# Altium schematic sheet Sheet4_MCU_Sensors.SchDoc
size A; SheetNumber: 4; SheetTotal: 6
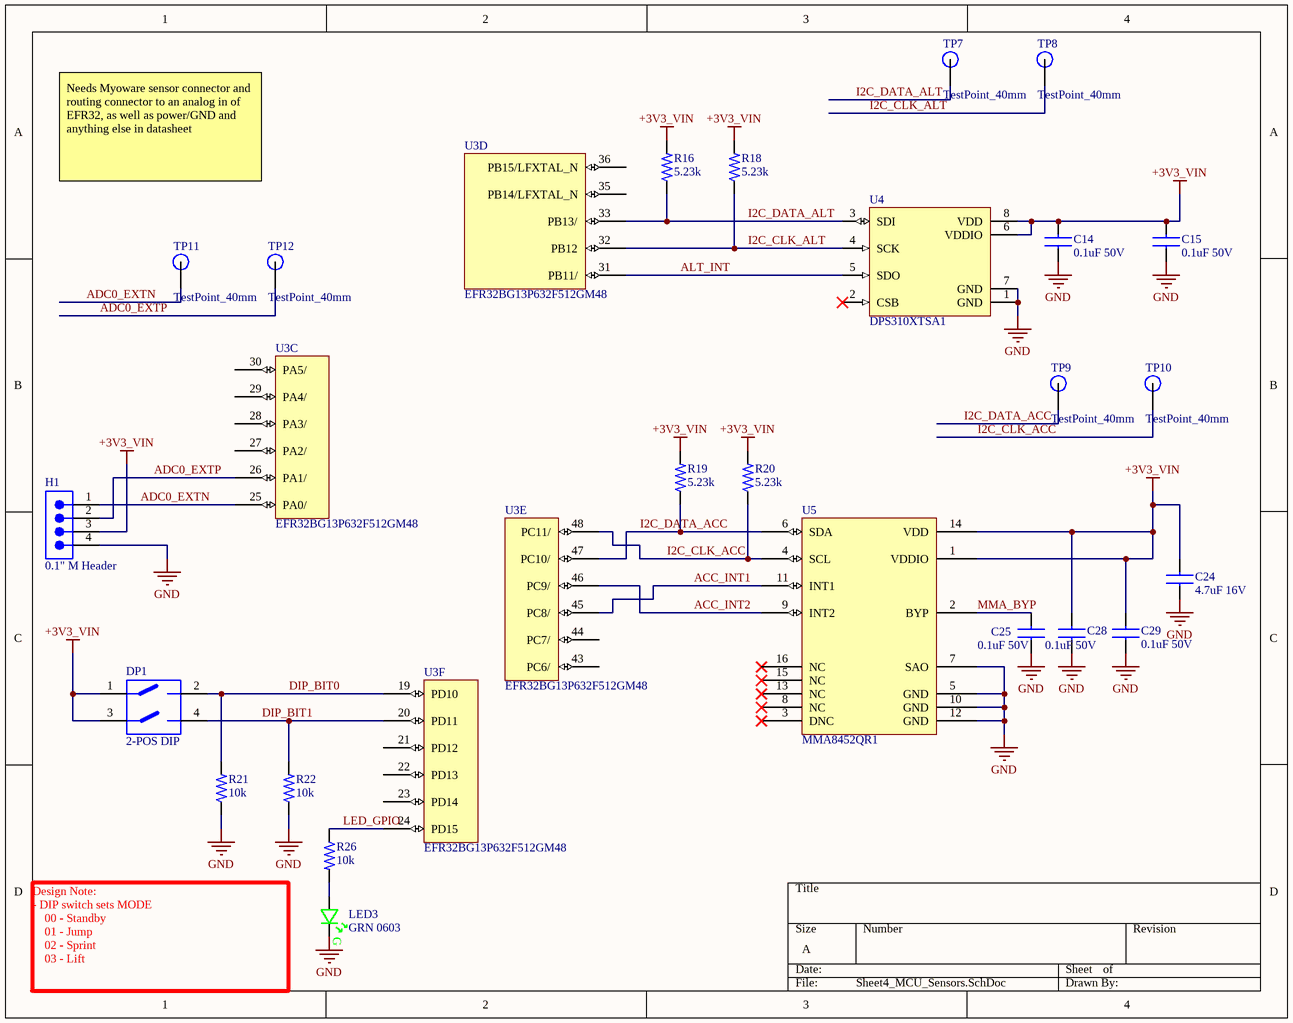
[diagram p0: Sheet4_MCU_Sensors.SchDoc]

## Parts
C14  0.1uF 50V  [CAP_0603_1MM]
C15  0.1uF 50V  [CAP_0603_1MM]
C24  4.7uF 16V  [CAP_0805_1_4MM]
C25  0.1uF 50V  [CAP_0603_1MM]
C28  0.1uF 50V  [CAP_0603_1MM]
C29  0.1uF 50V  [CAP_0603_1MM]
DP1  2-POS DIP  [4-PIN_DIP_2.54MM]
H1  0.1" M Header  [4-PIN_MALE_HEADER_01-IN]
LED3  GRN 0603  [LED_0603_GRN_WL-SMCW]
R16  5.23k  [RES_0603_1608X06]
R18  5.23k  [RES_0603_1608X06]
R19  5.23k  [RES_0603_1608X06]
R20  5.23k  [RES_0603_1608X06]
R21  10k  [RES_0805_2X1_25MM]
R22  10k  [RES_0805_2X1_25MM]
R26  10k  [RES_0805_2X1_25MM]
TP7  TestPoint_40mm  [TP_40MM]
TP8  TestPoint_40mm  [TP_40MM]
TP9  TestPoint_40mm  [TP_40MM]
TP10  TestPoint_40mm  [TP_40MM]
TP11  TestPoint_40mm  [TP_40MM]
TP12  TestPoint_40mm  [TP_40MM]
U3  EFR32BG13P632F512GM48  [QFN50P700X700X90_HS-49N]  (parts C,D,E,F of 7)
U4  DPS310XTSA1  [8-VLGA_2x2_5x1]
U5  MMA8452QR1  [MMA8452]

## Nets
+3V3_VIN: C14.1 C15.1 C24.2 C28.1 C29.1 DP1.1 DP1.3 H1.3 R16.2 R18.2 R19.2 R20.2 U4.6(VDDIO) U4.8(VDD) U5.1(VDDIO) U5.14(VDD)
GND: C14.2 C15.2 C24.1 C25.2 C28.2 C29.2 H1.4 LED3.C R21.1 R22.1 U4.1(GND) U4.7(GND) U5.5(GND) U5.7(SAO) U5.10(GND) U5.12(GND)
ACC_INT1: U3.45(PC8/) U5.11(INT1)
ACC_INT2: U3.46(PC9/) U5.9(INT2)
ADC0_EXTN: H1.1 TP11.1 U3.25(PA0/)
ADC0_EXTP: H1.2 TP12.1 U3.26(PA1/)
ALT_INT: U3.31(PB11/) U4.5(SDO)
DIP_BIT0: DP1.2 R21.2 U3.19(PD10)
DIP_BIT1: DP1.4 R22.2 U3.20(PD11)
I2C_CLK_ACC: R20.1 TP10.1 U3.48(PC11/) U5.4(SCL)
I2C_CLK_ALT: R18.1 TP8.1 U3.32(PB12) U4.4(SCK)
I2C_DATA_ACC: R19.1 TP9.1 U3.47(PC10/) U5.6(SDA)
I2C_DATA_ALT: R16.1 TP7.1 U3.33(PB13/) U4.3(SDI)
LED_GPIO: R26.1 U3.24(PD15)
MMA_BYP: C25.1 U5.2(BYP)
NetLED3_A: LED3.A R26.2

Not connected (* = marked no-connect by the designer): U3 21(PD12) 22(PD13) 23(PD14) 27(PA2/) 28(PA3/) 29(PA4/) 30(PA5/) 35(PB14/LFXTAL_N) 36(PB15/LFXTAL_N) 43(PC6/) 44(PC7/); U4 2(CSB)*; U5 3(DNC)* 8(NC)* 13(NC)* 15(NC)* 16(NC)*

## Notes on the sheet
- Needs Myoware sensor connector and routing connector to an analog in of EFR32, as well as power/GND and anything else in datasheet
- Design Note:
  - DIP switch sets MODE
  00 - Standby
  01 - Jump
  02 - Sprint
  03 - Lift
- (in symbol 150060GS75000) G

## Library data of the parts
C14 C15 C25 C28 C29 = CC0603KRX7R9BB104: CAPACITOR CERAMIC, 0.1UF, 50V, X7R, 10%, 0603; Manufacturer: Yageo; Capacitance: 100nF; Supplier 1: Digi-Key; Manufacturer Part Number: CC0603KRX7R9BB104; RoHS: Yes; Category: Ceramic Capacitors; Stock 1: 8863982; Pricing 1: 1=0.10000, 10=0.05900, 50=0.03240, 100=0.02640, 500=0.01886, 1000=0.01482 (USD); Mount: Surface Mount; Case/Package: 0603; Number of Pins: 2; Case Code (Metric): 1608; Case Code (Imperial): 0603; Dielectric Material: Ceramic; Min Operating Temperature: -55°C; Max Operating Temperature: 125°C; Package Quantity: 1; Voltage Rating: 50V; Tolerance: 10%; Packaging: Tape and Reel; Dielectric: X7R; Termination: SMD/SMT; Voltage: 50V; Series: CC; Length: 1.6mm; Width: 0.031inch; Height: 0.8mm; Thickness: 0.035inch; Depth: 0.8mm; Radiation Hardening: No; REACH SVHC: No SVHC; Lead Free: Lead Free; Halogen Free: Halogen Free; RoHS Compliant: Yes; ComponentLink1URL: https://datasheet.ciiva.com/11786/0900766b80d84f1d-11786061.pdf?src-supplier=RSComponents; ComponentLink1Description: https://datasheet.ciiva.com/11786/0900766b80d84f1d-11786061.pdf?src-supplier=RSComponents; ComponentLink2URL: https://datasheet.ciiva.com/144/mlccorderingcode-144176.pdf?src-supplier=Digi-Key; ComponentLink2Description: https://datasheet.ciiva.com/144/mlccorderingcode-144176.pdf?src-supplier=Digi-Key; ComponentLink3URL: https://datasheet.ciiva.com/144/mlccorderingcode-144177.pdf?src-supplier=Digi-Key; ComponentLink3Description: https://datasheet.ciiva.com/144/mlccorderingcode-144177.pdf?src-supplier=Digi-Key; ComponentLink4URL: https://datasheet.ciiva.com/144/mlccorderingcode-144178.pdf?src-supplier=Digi-Key; ComponentLink4Description: https://datasheet.ciiva.com/144/mlccorderingcode-144178.pdf?src-supplier=Digi-Key; ComponentLink5URL: https://datasheet.ciiva.com/31394/1489800-31394927.pdf?src-supplier=Farnell; ComponentLink5Description: https://datasheet.ciiva.com/31394/1489800-31394927.pdf?src-supplier=Farnell; ComponentLink6URL: https://datasheet.ciiva.com/8033/70765-8033819.pdf?src-supplier=Element14; ComponentLink6Description: https://datasheet.ciiva.com/8033/70765-8033819.pdf?src-supplier=Element14; ComponentLink7URL: https://datasheet.ciiva.com/8033/70765-8033821.pdf?src-supplier=Element14; ComponentLink7Description: https://datasheet.ciiva.com/8033/70765-8033821.pdf?src-supplier=Element14; ComponentLink8URL: https://datasheet.ciiva.com/22749/1489800-22749214.pdf?src-supplier=Element14; ComponentLink8Description: https://datasheet.ciiva.com/22749/1489800-22749214.pdf?src-supplier=Element14; ComponentLink9URL: https://datasheet.ciiva.com/7978/1489800-7978166.pdf?src-supplier=Element14; ComponentLink9Description: https://datasheet.ciiva.com/7978/1489800-7978166.pdf?src-supplier=Element14; ComponentLink10URL: https://datasheet.ciiva.com/16625/upy-gphc-x7r-6-3v-to-50v-8-16625530.pdf?src-supplier=Avnet+Europe; ComponentLink10Description: https://datasheet.ciiva.com/16625/upy-gphc-x7r-6-3v-to-50v-8-16625530.pdf?src-supplier=Avnet+Europe
C24 = CL21A475KOFNNNG: CAP CER 4.7UF 16V X5R 0805; Manufacturer: Samsung; Material: Ceramic; Tolerance: 10%; Supplier 1: Digi-Key; Manufacturer Part Number: CL21A475KOFNNNG; RoHS: Yes; Category: Ceramic Capacitors; Stock 1: 18827; Pricing 1: 1=0.12000, 10=0.08800, 50=0.05000, 100=0.04140, 500=0.02906, 1000=0.02405 (USD); Mount: Surface Mount; Case/Package: 0805; Case Code (Metric): 2012; Case Code (Imperial): 0805; Min Operating Temperature: -55°C; Max Operating Temperature: 85°C; Capacitance: 4.7uF; Package Quantity: 3000; Packaging: Tape and Reel; Voltage Rating: 16V; Dielectric: X5R; Voltage: 16V; Series: CL; Length: 2mm; Width: 0.049inch; Height: 1.25mm; Thickness: 0.053inch; Depth: 1.25mm; Lead Free: Lead Free; RoHS Compliant: Yes; ComponentLink1URL: https://datasheet.ciiva.com/25731/cl21a475kofnnng-25731814.pdf?src-supplier=Digi-Key; ComponentLink1Description: https://datasheet.ciiva.com/25731/cl21a475kofnnng-25731814.pdf?src-supplier=Digi-Key; ComponentLink2URL: https://datasheet.ciiva.com/29199/455276-da-01-en-vs-kondensator-0805-29199361.pdf?src-supplier=Conrad; ComponentLink2Description: https://datasheet.ciiva.com/29199/455276-da-01-en-vs-kondensator-0805-29199361.pdf?src-supplier=Conrad; ComponentLink3URL: https://datasheet.ciiva.com/26310/mlcc-catalogdownload2013-eng-26310158.pdf?src-supplier=Distrelec; ComponentLink3Description: https://datasheet.ciiva.com/26310/mlcc-catalogdownload2013-eng-26310158.pdf?src-supplier=Distrelec; ComponentLink4URL: https://datasheet.ciiva.com/16428/cl05b104kq5nnnc-16428879.pdf?src-supplier=Future+Electronics; ComponentLink4Description: https://datasheet.ciiva.com/16428/cl05b104kq5nnnc-16428879.pdf?src-supplier=Future+Electronics
DP1 = 206-2: SWITCH SLIDE DIP SPST 50MA 24V
H1 = PRPC004SAAN-RC: CONN HEADER VERT 4POS 2.54MM; Manufacturer: Sullins; Connector Type: Header, Unshrouded, Breakaway; Number of Positions: 4; Number of Positions Loaded: All; Pitch: 0.100" (2.54mm); Online Catalog: 0.100" (2.54mm) Pitch Connector Headers; Other Names: S9510E-04  S9510E-04-ND; Supplier 1: Digi-Key; Manufacturer Part Number: PRPC004SAAN-RC; Stock 1: 6306; Pricing 1: 1=0.15, 10=0.146, 25=0.1084, 50=0.0928, 100=0.0898, 250=0.0774, 500=0.0743 (USD); Standard Package: 1; Category: Connectors, Interconnects; Family: Rectangular Connectors - Headers, Male Pins; Series: -; Packaging: Bulk; Contact Type: Male Pin; Number of Rows: 1; Row Spacing: -; Contact Mating Length: 0.230" (5.84mm); Mounting Type: Through Hole; Termination: Solder; Fastening Type: -; Features: -; Contact Finish: Gold; Contact Finish Thickness: Flash; Color: Black; ComponentLink1URL: https://media.digikey.com/PDF/Data%20Sheets/Sullins%20PDFs/xRxCzzzSxxN-RC_ST_11635-B.pdf?src-supplier=Digi-Key; ComponentLink1Description: https://media.digikey.com/PDF/Data%20Sheets/Sullins%20PDFs/xRxCzzzSxxN-RC_ST_11635-B.pdf?src-supplier=Digi-Key; Supplier Part Number 1: S1011EC-04-ND
LED3 = 150060GS75000: LED, 0603, GREEN, 430MCD, 520NM; Manufacturer: Wurth Electronics; Dynamic Catalog: 0603 Rectangle with Flat Top Chip LEDs; 3D Model: SMCW_0603.igs / SMCW_0603.stp / SMCW_0603.wrl; Wavelength - Peak: 515nm; Voltage - Forward (Vf) (Typ): 3.2V; Current - Test: 20mA; Viewing Angle: 140°; Lens Type: Clear; Lens Style/Size: Rectangle with Flat Top, 1.1mm x 0.7mm; Other Names: 732-4971-2; Supplier 1: Digi-Key; Manufacturer Part Number: 150060GS75000; Stock 1: 34964; Pricing 1: 1=0.14, 50=0.129, 100=0.11, 500=0.095 (USD); Standard Package: 4,000; Category: Optoelectronics; Family: LED Indication - Discrete; Series: WL-SMCW; Packaging: Tape & Reel (TR); Color: Green; Wavelength - Dominant: 520nm; Millicandela Rating: 430mcd; Package / Case: 0603 (1608 Metric); Size / Dimension: 1.60mm L x 0.80mm W; Height: 0.70mm; Mounting Type: Surface Mount; Online Catalog: 0603 Rectangle with Flat Top Chip LEDs; ComponentLink1URL: https://katalog.we-online.de/led/datasheet/150060GS75000.pdf?src-supplier=Digi-Key; ComponentLink1Description: https://katalog.we-online.de/led/datasheet/150060GS75000.pdf?src-supplier=Digi-Key; ComponentLink2URL: http://www.produktinfo.conrad.com/datenblaetter/750000-774999/759427-da-01-en-CHIPLED_0603_W_KL_GRUEN_150060GS75000.pdf?src-supplier=Conrad; ComponentLink2Description: http://www.produktinfo.conrad.com/datenblaetter/750000-774999/759427-da-01-en-CHIPLED_0603_W_KL_GRUEN_150060GS75000.pdf?src-supplier=Conrad; Supplier Part Number 1: 732-4971-1-ND
R16 R18-R20 = RMCF0603FT5K23: RES SMD 5.23K OHM 1% 1/10W 0603; Manufacturer: Stackpole Electronics; Resistance: 5.23kR; Max Power Dissipation: 100mW; Temperature Coefficient: 100ppm/°C; Supplier 1: Digi-Key; Manufacturer Part Number: RMCF0603FT5K23; RoHS: Yes; Category: Chip SMD Resistors; Stock 1: 29980; Pricing 1: 1=0.10000, 10=0.01600, 100=0.00650, 1000=0.00292, 2500=0.00253 (USD); Mount: Surface Mount; Case/Package: 0603; Case Code (Metric): 1608; Case Code (Imperial): 0603; Contact Plating: Tin,Matte; Min Operating Temperature: -55°C; Max Operating Temperature: 155°C; Tolerance: 1%; Features: Automotive AEC-Q200; Packaging: Tape and Reel; Resistor Type: Thick Film; Number of Terminations: 2; Series: RMCF; Length: 0.061inch; Width: 0.031inch; Height: 0.022inch; Radiation Hardening: No; Lead Free: Lead Free; RoHS Compliant: Yes; ComponentLink1URL: https://www.seielect.com/Catalog/SEI-RMCF_RMCP.pdf?src-supplier=Digi-Key; ComponentLink1Description: https://www.seielect.com/Catalog/SEI-RMCF_RMCP.pdf?src-supplier=Digi-Key; ComponentLink2URL: https://www.seielect.com/catalog/SEI-Packaging.pdf?src-supplier=Digi-Key; ComponentLink2Description: https://www.seielect.com/catalog/SEI-Packaging.pdf?src-supplier=Digi-Key; ComponentLink3URL: https://www.seielect.com/catalog/SEI-RMCF_RMCP.pdf?src-supplier=Avnet; ComponentLink3Description: https://www.seielect.com/catalog/SEI-RMCF_RMCP.pdf?src-supplier=Avnet
R21 R22 R26 = RMCF0805FT10K0: RES 10K OHM 1% 1/8W 0805; Manufacturer: Stackpole Electronics; Resistance: 10kR; Power Rating: 125mW; Temperature Coefficient: 100ppm/°C; Supplier 1: Digi-Key; Manufacturer Part Number: RMCF0805FT10K0; RoHS: Yes; Category: Chip SMD Resistors; Stock 1: 2466676; Pricing 1: 1=0.10000, 10=0.02600, 100=0.01040, 1000=0.00466, 2500=0.00405 (USD); Mount: Surface Mount; Case/Package: 0805; Case Code (Metric): 2012; Case Code (Imperial): 0805; Contact Plating: Tin,Matte; Size Code: 0805; Min Operating Temperature: -55°C; Max Operating Temperature: 155°C; Tolerance: 1%; Packaging: Tape and Reel; Resistor Type: Thick Film; Number of Terminations: 2; Max Power Dissipation: 125mW; Features: Automotive AEC-Q200; Series: RMCF; Construction: Rectangular; Length: 2mm; Width: 0.049inch; Height: 0.026inch; Depth: 1.25mm; Radiation Hardening: No; Lead Free: Lead Free; Military Standard: Not; RoHS Compliant: Yes; ComponentLink1URL: https://datasheet.ciiva.com/15193/getdatasheetpartid-362046-15193525.pdf?src-supplier=Verical; ComponentLink1Description: https://datasheet.ciiva.com/15193/getdatasheetpartid-362046-15193525.pdf?src-supplier=Verical
U3 = EFR32BG13P732F512GM48-B_1: BLUE PREMIUM QFN48 2.4G 19 DBM B; Manufacturer: Silicon Labs; Interface: I2C,UART,USART; Frequency: 2.4GHz; Data Rate: 2Mbps; Sensitivity: -102dBm; Memory Size: 64KB; Number of GPIO: 31; Current - Receiving: 11mA; Current - Transmitting: 8.5mA; Supplier 1: Digi-Key; Manufacturer Part Number: EFR32BG13P732F512GM48-B; RoHS: Yes; Category: RF Receivers, Transceivers; Stock 1: 19; Pricing 1: 1=6.48000, 25=6.24040, 100=6.00030, 1000=5.98905 (USD); Min Operating Temperature: -40°C; Max Operating Temperature: 85°C; Packaging: Tray; RoHS Compliant: Yes; ComponentLink1URL: https://www.silabs.com/documents/login/data-sheets/efr32bg13-datasheet.pdf?src-supplier=Digi-Key; ComponentLink1Description: https://www.silabs.com/documents/login/data-sheets/efr32bg13-datasheet.pdf?src-supplier=Digi-Key
U4 = DPS310XTSA1: INFINEON - DPS310XTSA1 - Pressure Sensor, Barometric, 17.404 psi, 4.351 psi, 1.7 V, 3.6 V; Interface: I2C,SPI; Max Supply Voltage: 3.6V; Output Type: SPI,I2C; Pressure Type: Vented Gauge; Operating Pressure: 17.4PSI; Max Pressure: 145PSI; Supplier 1: Digi-Key; Manufacturer: Infineon; Manufacturer Part Number: DPS310XTSA1; RoHS: Yes; Category: Pressure Sensors; Stock 1: 17160; Pricing 1: 1=2.89000, 5=2.68200, 10=2.22800, 25=1.85640, 50=1.65000, 100=1.56750, 500=1.32000, 1000=1.23750 (USD); Case/Package: LGA; Number of Pins: 8; Min Operating Temperature: -40°C; Max Operating Temperature: 85°C; Termination: SMD/SMT; Lead Free: Lead Free; Halogen Free: Halogen Free; RoHS Compliant: Yes; ComponentLink1URL: http://www.farnell.com/datasheets/2211517.pdf?src-supplier=Farnell; ComponentLink1Description: http://www.farnell.com/datasheets/2211517.pdf?src-supplier=Farnell; ComponentLink2URL: https://www.infineon.com/dgdl/Infineon-DPS310-DS-v01_00-EN.pdf?fileId=5546d462576f34750157750826c42242&src-supplier=Digi-Key; ComponentLink2Description: https://www.infineon.com/dgdl/Infineon-DPS310-DS-v01_00-EN.pdf?fileId=5546d462576f34750157750826c42242&src-supplier=Digi-Key; ComponentLink3URL: http://www.farnell.com/datasheets/2211517.pdf?src-supplier=Newark; ComponentLink3Description: http://www.farnell.com/datasheets/2211517.pdf?src-supplier=Newark; ComponentLink4URL: http://www.farnell.com/datasheets/2211517.pdf?src-supplier=Element14; ComponentLink4Description: http://www.farnell.com/datasheets/2211517.pdf?src-supplier=Element14
U5 = MMA8452QR1: Accelerometer Triple ±2g/±4g/±8g 2.5V 16-Pin QFN T/R; Manufacturer: NXP Freescale; Bandwidth: 400Hz; Interface: I2C; Max Supply Voltage: 3.6V; Min Supply Voltage: 1.95V; Resolution: 12b; Output Type: I2C,Digital; Axis: X, Y, Z; Supplier 1: Newark; Manufacturer Part Number: MMA8452QR1; RoHS: Yes; Category: Accelerometers; Pricing 1: 1=2.49000, 10=1.57000, 25=1.51000, 50=1.46000, 100=1.40000 (USD); Mount: Surface Mount; Case/Package: QFN; Number of Pins: 16; Weight: 0.001122oz; Contact Plating: Gold; Min Operating Temperature: -40°C; Max Operating Temperature: 85°C; Package Quantity: 1000; Packaging: Tape and Reel; Series: -; Length: 3mm; Depth: 3mm; Radiation Hardening: No; REACH SVHC: No SVHC; RoHS Compliant: Yes; ComponentLink1URL: https://datasheet.ciiva.com/6484/mma8452q-6484545.pdf?src-supplier=Digi-Key; ComponentLink1Description: https://datasheet.ciiva.com/6484/mma8452q-6484545.pdf?src-supplier=Digi-Key; ComponentLink2URL: https://datasheet.ciiva.com/5296/mma8452q-64080-5296451.pdf?src-supplier=Mouser; ComponentLink2Description: https://datasheet.ciiva.com/5296/mma8452q-64080-5296451.pdf?src-supplier=Mouser; ComponentLink3URL: https://datasheet.ciiva.com/26025/mma8452q-26025828.pdf?src-supplier=Avnet+Europe; ComponentLink3Description: https://datasheet.ciiva.com/26025/mma8452q-26025828.pdf?src-supplier=Avnet+Europe; ComponentLink4URL: https://datasheet.ciiva.com/41459/001183459-da-01-en-ic-acceler-2g-4g-8-mma8452qr1-qfn-16-fre-41459457.pdf?src-supplier=Conrad; ComponentLink4Description: https://datasheet.ciiva.com/41459/001183459-da-01-en-ic-acceler-2g-4g-8-mma8452qr1-qfn-16-fre-41459457.pdf?src-supplier=Conrad; ComponentLink5URL: https://datasheet.ciiva.com/6484/mma8452q-6484518.pdf?src-supplier=Digi-Key; ComponentLink5Description: https://datasheet.ciiva.com/6484/mma8452q-6484518.pdf?src-supplier=Digi-Key; ComponentLink6URL: https://datasheet.ciiva.com/6484/mma8452q-6484517.pdf?src-supplier=Digi-Key; ComponentLink6Description: https://datasheet.ciiva.com/6484/mma8452q-6484517.pdf?src-supplier=Digi-Key; ComponentLink7URL: https://datasheet.ciiva.com/3271/mma8452q-3271581.pdf?src-supplier=Avnet; ComponentLink7Description: https://datasheet.ciiva.com/3271/mma8452q-3271581.pdf?src-supplier=Avnet